# EAGLE design Super-Regenerative-FM-Tuner (EAGLE 7.6.0)
Forced quenching improves three-transistor FM tuner Lyle Williams -February 29, 2016 http://www.edn.com/design/diy/4441531/Forced-quenching-improves-three-transistor-FM-tuner
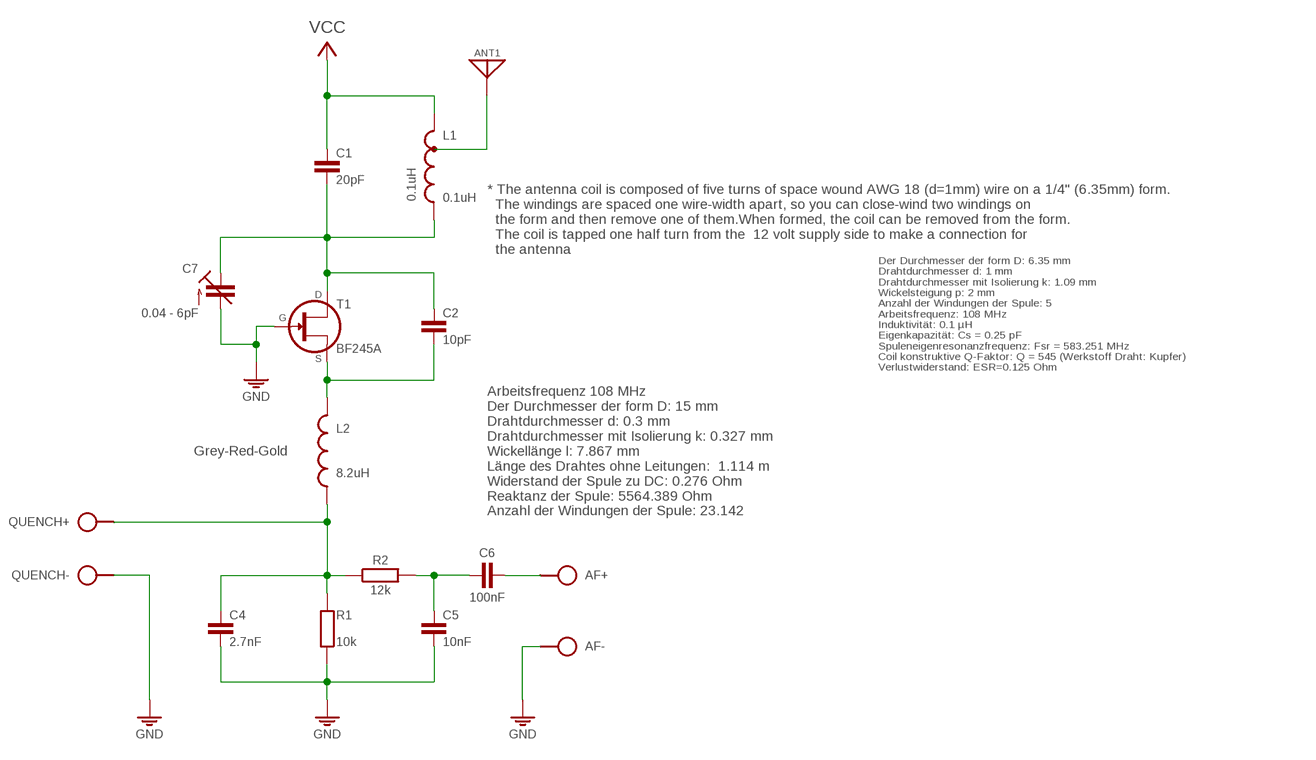
[diagram p0: schematic, sheet 1]

## Parts
AF  SPAD+-+-  [SPAD+-]
ANT1  ANT  [SPAD]
C1  20pF  C025-015X024  [C025-015X024]
C2  10pF  C025-015X024  [C025-015X024]
C4  2.7nF  C050-020X044  [C050-020X044]
C5  10nF  C050-020X044  [C050-020X044]
C6  100nF  C-H050-020X044  [C050-020X044]
C7  0.04 - 6pF  C-TR-PH20127-TZ03  [CTRIMTZ03]
L1  0.1uH  L-TAP1L-08/10V-TAP1  [L-08/10V-TAP1]
L2  8.2uH  L04/7-V  [L-04/7-V]
PWR  VCC_GNDL  [SPAD-+]
QUENCH  SPAD+--+  [SPAD-+]
R1  10k  R0204/10-V  [0204/10-V]
R2  12k  R-H0204/10-V  [0204/10-V]
T1  BF245A  BF245BTO92  [TO92-GSD]

## Nets
GND: AF.1 C4.2 C5.2 C7.1(A) PWR.1 QUENCH.1 R1.2 T1.1(G)
N$1: C1.2 C2.1 C7.2(E) L1.2 T1.3(D)
N$2: C4.1 L2.2 QUENCH.2 R1.1 R2.1
N$4: ANT1.1 L1.3(T)
N$5: C2.2 L2.1 T1.2(S)
N$6: C5.1 C6.1 R2.2
N$8: AF.2 C6.2
VCC: C1.1 L1.1 PWR.2

## Notes on the sheet
- * The antenna coil is composed of five turns of space wound AWG 18 (d=1mm) wire on a 1/4" (6.35mm) form.
    The windings are spaced one wire-width apart, so you can close-wind two windings on
    the form and then remove one of them.When formed, the coil can be removed from the form.
    The coil is tapped one half turn from the  12 volt supply side to make a connection for
    the antenna
- Der Durchmesser der form D: 6.35 mm
  Drahtdurchmesser d: 1 mm
  Drahtdurchmesser mit Isolierung k: 1.09 mm
  Wickelsteigung p: 2 mm
  Anzahl der Windungen der Spule: 5
  Arbeitsfrequenz: 108 MHz
  Induktivität: 0.1 µH
  Eigenkapazität: Cs = 0.25 pF
  Spuleneigenresonanzfrequenz: Fsr = 583.251 MHz
  Coil konstruktive Q-Faktor: Q = 545 (Werkstoff Draht: Kupfer)
  Verlustwiderstand: ESR=0.125 Ohm
- Grey-Red-Gold
- Arbeitsfrequenz 108 MHz
  Der Durchmesser der form D: 15 mm
  Drahtdurchmesser d: 0.3 mm
  Drahtdurchmesser mit Isolierung k: 0.327 mm
  Wickellänge l: 7.867 mm
  Länge des Drahtes ohne Leitungen:  1.114 m
  Widerstand der Spule zu DC: 0.276 Ohm
  Reaktanz der Spule: 5564.389 Ohm
  Anzahl der Windungen der Spule: 23.142

## Library data of the parts
AF QUENCH = pad:SPAD+-
ANT1 = pad:ANT
C1 C2 C4 C5 = c:C: CAPACITOR, European symbol
C6 = c:C-H
C7 = cap-trim:C-TR-PH20127
L1 = l:L-TAP1
L2 = l:L: Potentiometers Beckman, Copal, Piher, Spectrol, Schukat Created by librarian@cadsoft.de
PWR = pad:VCC_GND
R1 = r:R: RESISTOR, European symbol
R2 = r:R-H
T1 = t:BF245B: Transistors

## Board
Forced quenching improves three-transistor FM tuner Lyle Williams -February 29, 2016 http://www.edn.com/design/diy/4441531/Forced-quenching-improves-three-transistor-FM-tuner
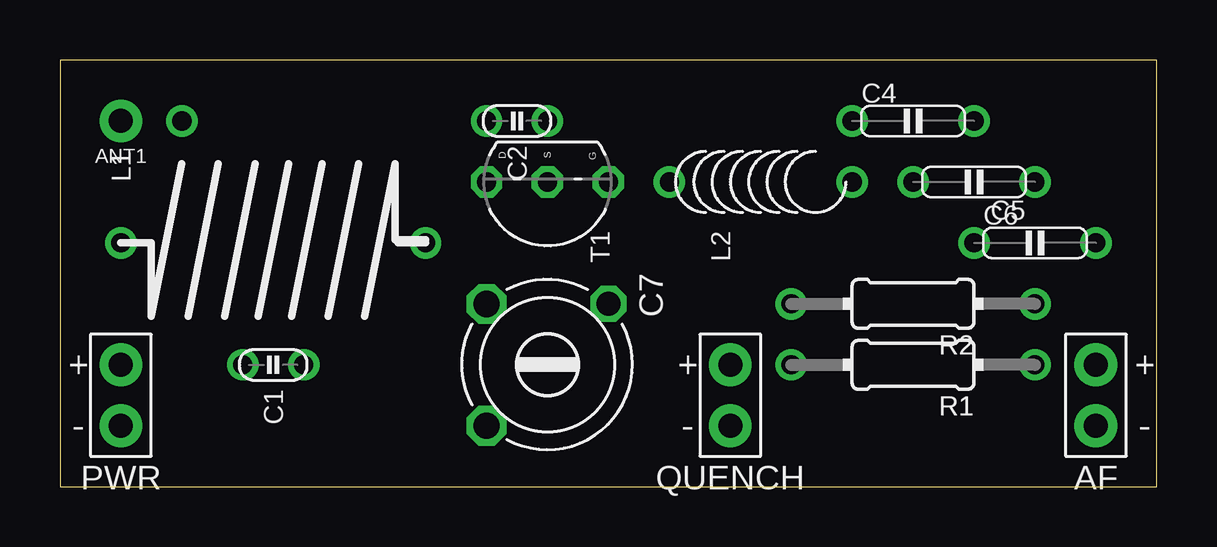
[diagram p1: board, top side]
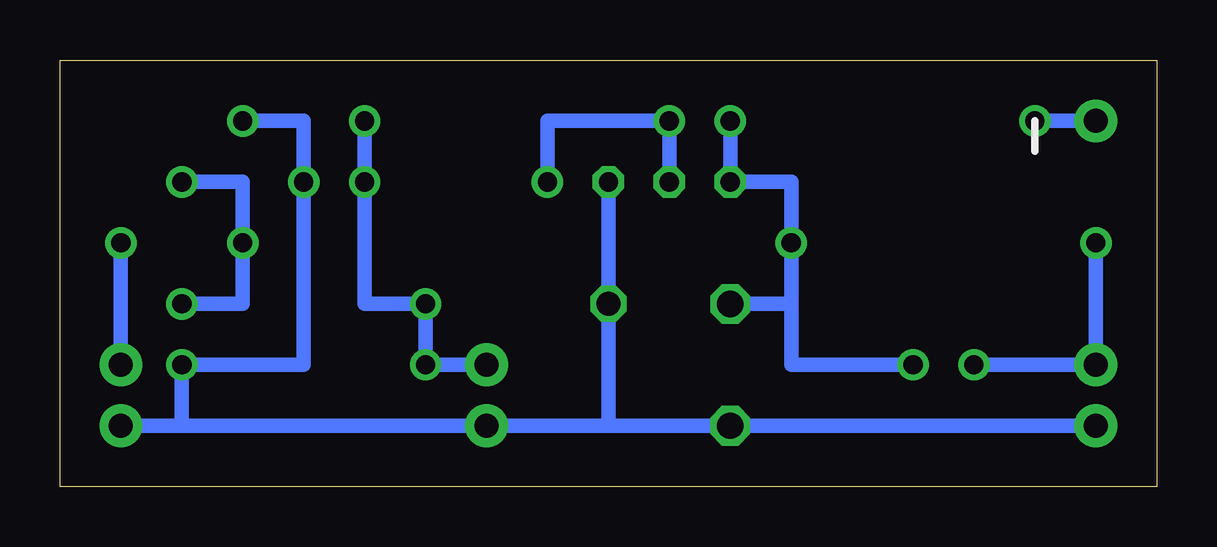
[diagram p2: board, bottom side, seen from below]

Size 45.72 x 17.78 mm. Coordinates in mm from the lower left corner, seen from the top.
Outline: 45.72,0 45.72,17.78 0,17.78 0,0 45.72,0
Copper layers (1*16): Top 0.035mm / dielectric 1.5mm / Bottom 0.035mm
Design rules "default": minimum track width 10mil, minimum drill 24mil, track to track 8mil, track to pad 8mil, pad to pad 8mil, via to via 8mil, smd to smd 8mil, copper to edge 40mil, drill to drill 8mil, minimum pad ring 10mil, minimum via ring 8mil, stop-mask expansion 4mil, vias tented up to drill 0mil, thermal gap 10mil

### Footprints (pad centres in the part's own frame; a part is rotated, then mirrored left to right if it is on the bottom)
SPAD+- = drill 1 pad 1.778: 1 0,-1.27; 2 0,1.27
SPAD = drill 1 pad 1.778: 1 0,0
C025-015X024 = drill 0.8: 1 0,1.27; 2 0,-1.27
C050-020X044 = drill 0.8: 1 -2.54,0; 2 2.54,0
TRIM808-45 = drill 1.1 octagon: 1 2.54,-2.54; 2 -2.54,-2.54 | drill 1 octagon: 3 -2.54,2.54
L-08/10V-TAP1 = drill 0.8: 1 0,6.35; 2 0,-6.35; 3 5.08,3.81
L-04/7-V = drill 0.8: 1 0,3.81; 2 0,-3.81
SPAD-+ = drill 1 pad 1.778: 1 0,-1.27; 2 0,1.27
0204/10-V = drill 0.8: 1 0,5.08; 2 0,-5.08
TO92-GSD = drill 0.8 octagon: 1 0,2.54; 2 0,0; 3 0,-2.54

### Placement (x,y rotation side)
AF  43.18,3.81 0 top
ANT1  2.54,15.24 90 top
C1  8.89,5.08 90 top
C2  19.05,15.24 90 top
C4  35.56,15.24 0 top
C5  38.1,12.7 180 top
C6  40.64,10.16 0 top
C7  0.04 - 6pF  [TRIM808-45]  20.32,5.08 270 top
L1  *  [L-08/10V-TAP1]  8.89,10.16 90 top
L2  29.21,12.7 90 top
PWR  2.54,3.81 0 top
QUENCH  27.94,3.81 0 top
R1  35.56,5.08 90 top
R2  35.56,7.62 90 top
T1  20.32,12.7 270 top

### Tracks (layer width: path | path; a pad name or v marks a point on that pad's centre or on a via)
GND
  Bottom 0.61: 22.86,2.54 C7.1 PWR.1 | 40.64,2.54 QUENCH.1 22.86,2.54 | C4.2 35.56,15.24 C5.2 35.56,5.08 R1.2 40.64,2.54 | AF.1 40.64,2.54 | 22.86,2.54 T1.1
N$1
  Bottom 0.61: C2.1 T1.3 15.24,12.7 L1.2 15.24,7.62 | C1.2 15.24,5.08 15.24,7.62 | C7.2 15.24,7.62
N$2
  Bottom 0.61: C4.1 L2.2 33.02,7.62 R2.1 R1.1 QUENCH.2
N$4
  Bottom 0.61: ANT1.1 L1.3
N$5
  Bottom 0.61: L2.1 25.4,15.24 C2.2 T1.2
N$6
  Bottom 0.61: R2.2 38.1,7.62 C6.1 38.1,12.7 C5.1
N$8
  Bottom 0.61: AF.2 C6.2
VCC
  Bottom 0.61: C1.1 PWR.2 L1.1